# EAGLE design PISO1 (EAGLE 9.6.2)
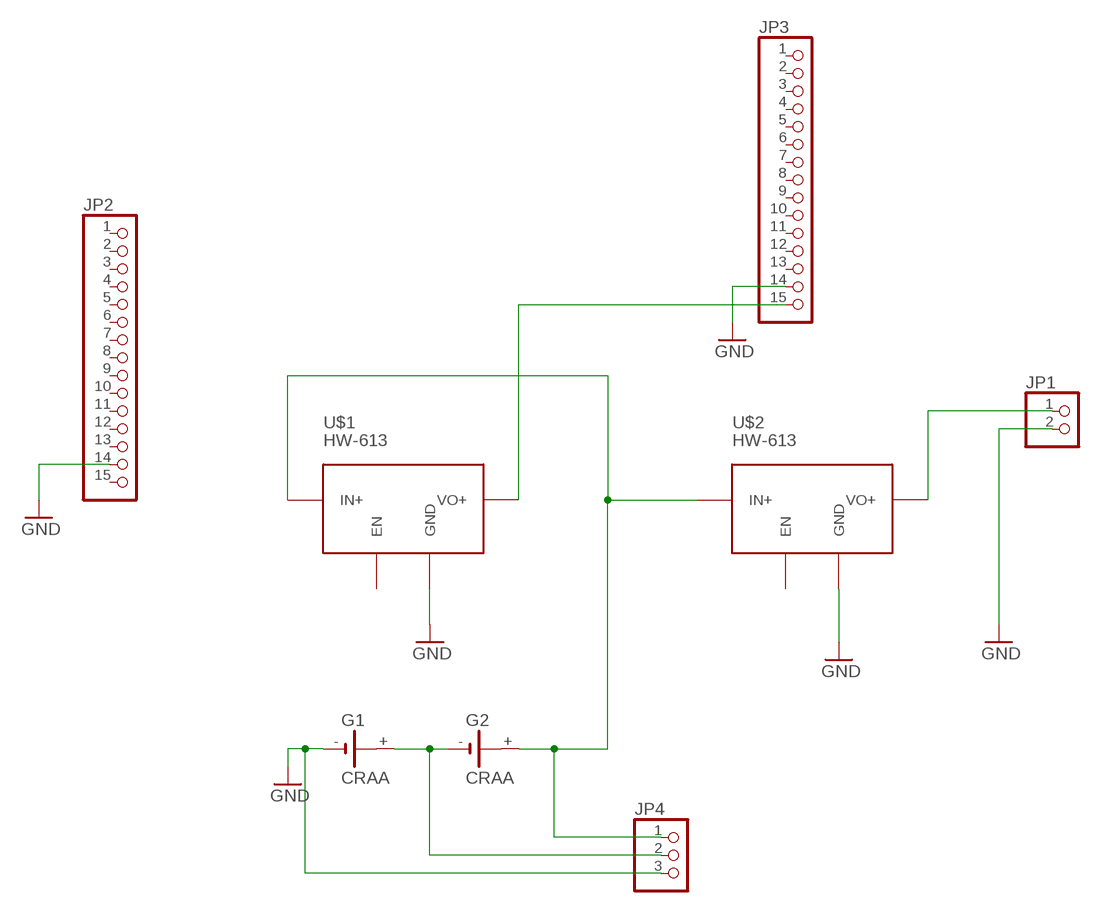
[diagram p0: schematic, sheet 1]

## Parts
G1  CRAA  [CRAA]
G2  CRAA  [CRAA]
JP1  PINHD-1X2/90  [1X02/90]
JP2  PINHD-1X15  [1X15]
JP3  PINHD-1X15  [1X15]
JP4  PINHD-1X3/90  [1X03/90]
U$1  HW-613  [HW-613]
U$2  HW-613  [HW-613]

## Nets
GND: G1.- JP1.2 JP2.14 JP3.14 JP4.3 U$1.GND U$2.GND
N$1: G1.+ G2.- JP4.2
N$4: G2.+ JP4.1 U$1.IN+ U$2.IN+
N$6: JP1.1 U$2.VO+
N$8: JP3.15 U$1.VO+
Unconnected: G1.+@1(+) G2.+@1(+) JP2.1 JP2.2 JP2.3 JP2.4 JP2.5 JP2.6 JP2.7 JP2.8 JP2.9 JP2.10 JP2.11 JP2.12 JP2.13 JP2.15 JP3.1 JP3.2 JP3.3 JP3.4 JP3.5 JP3.6 JP3.7 JP3.8 JP3.9 JP3.10 JP3.11 JP3.12 JP3.13 U$1.EN U$2.EN

## Library data of the parts
G1 G2 = battery:CRAA: LI BATTERY Varta
JP1 = pinhead:PINHD-1X2: PIN HEADER
JP2 JP3 = pinhead:PINHD-1X15: PIN HEADER
JP4 = pinhead:PINHD-1X3: PIN HEADER
U$1 U$2 = hw-613:HW-613: DC/DC Adjustable Step-Down Regulator based on MP2315 chip

## Board
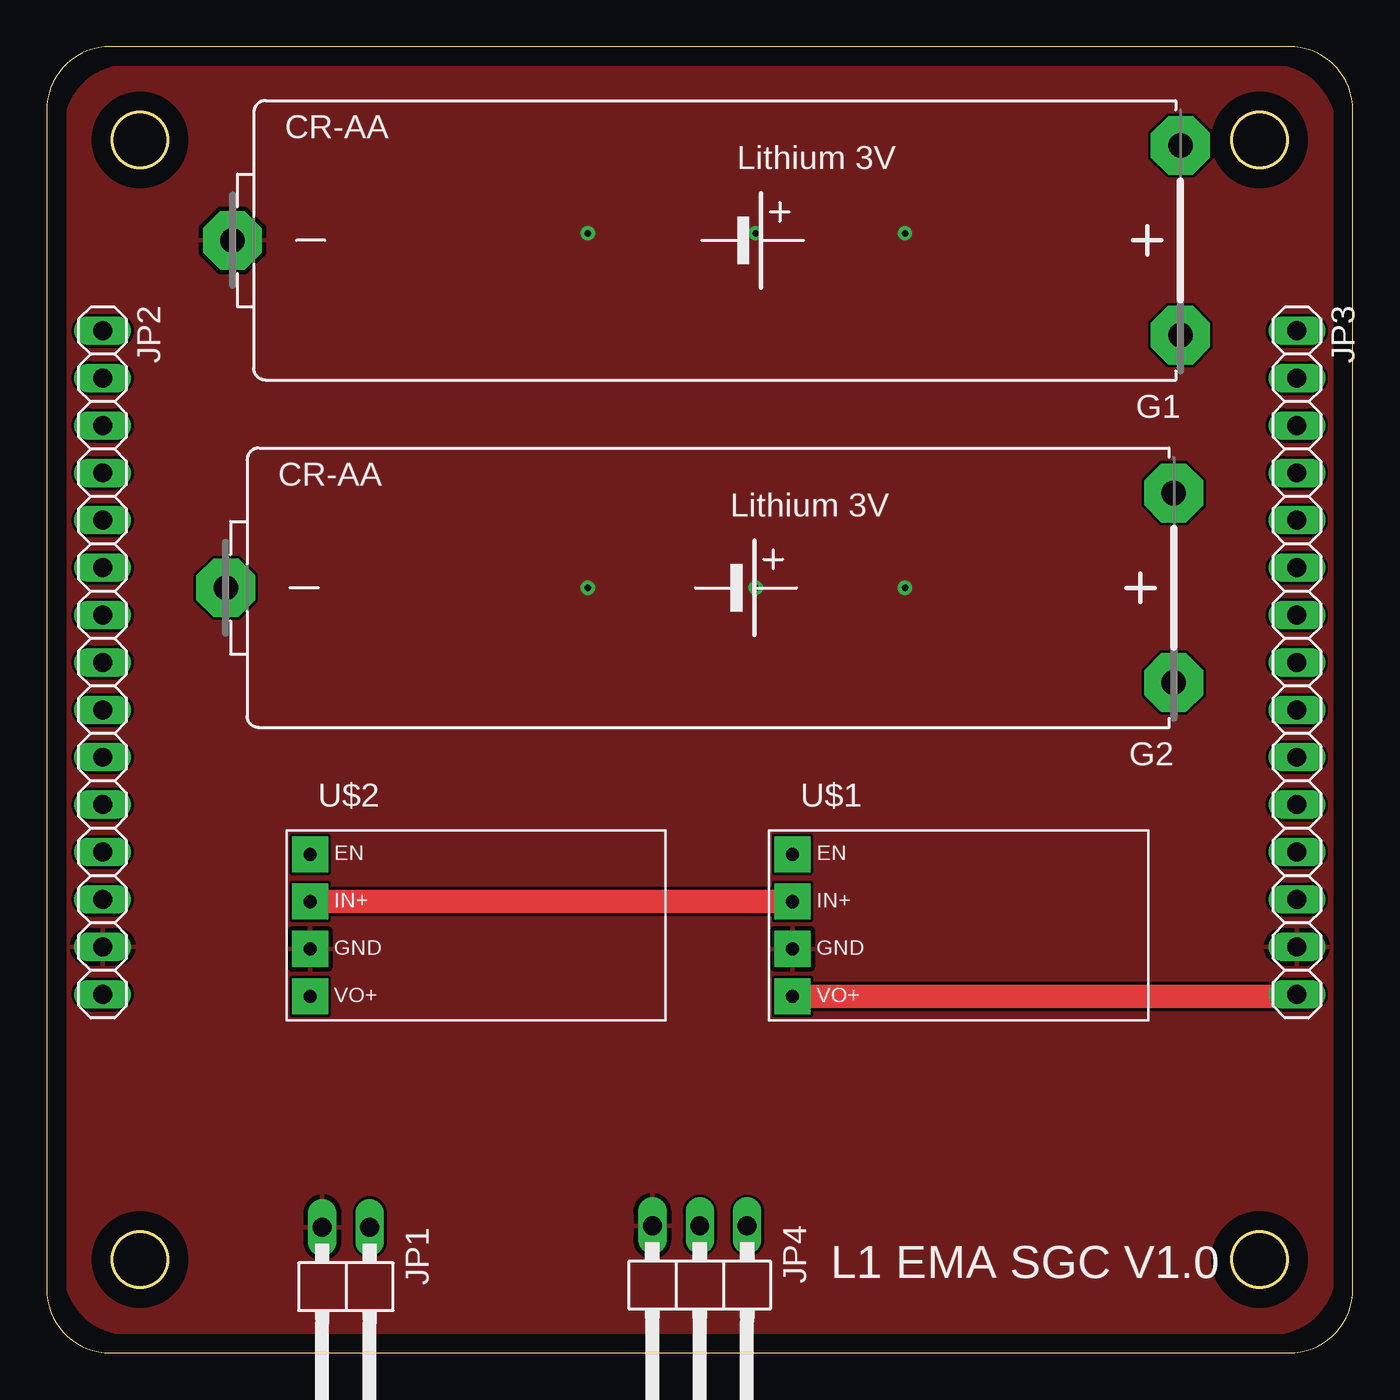
[diagram p1: board, top side]
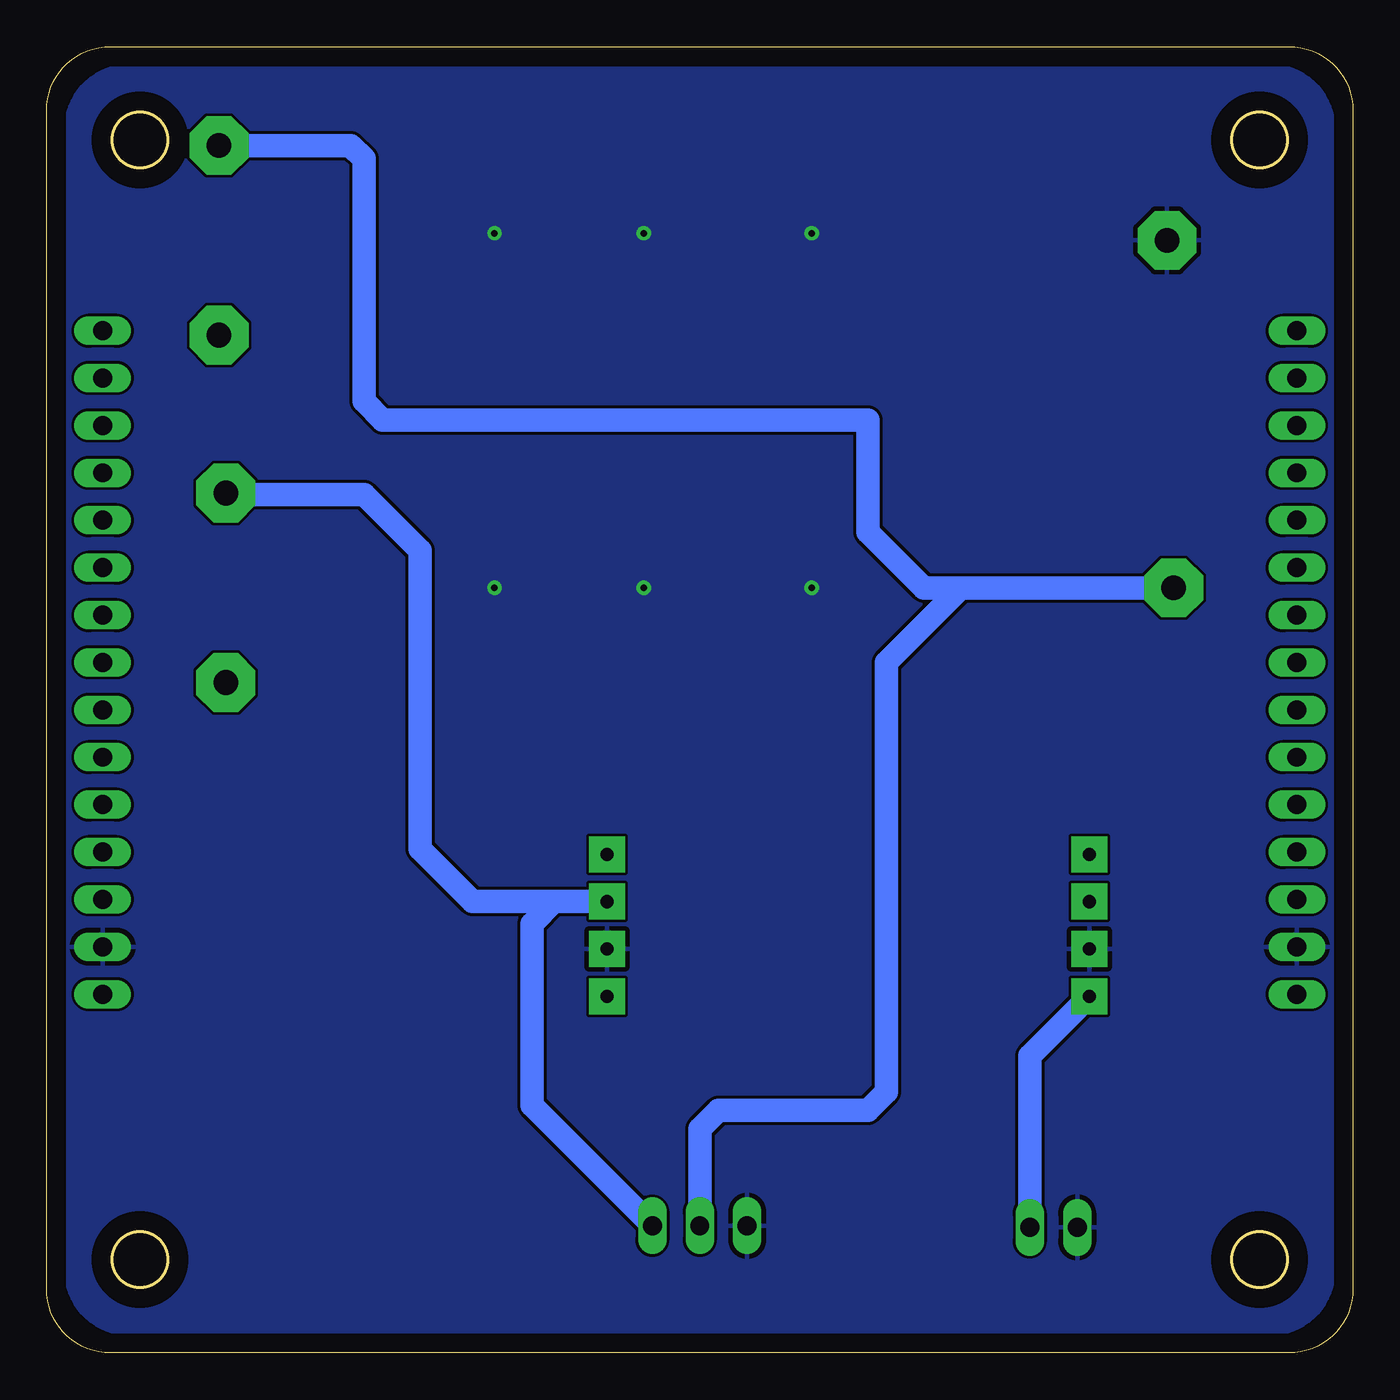
[diagram p2: board, bottom side, seen from below]

Size 70 x 70 mm. Coordinates in mm from the lower left corner, seen from the top.
Outline: 0,66.59 0,3.41 arc90 3.41,0 66.59,0 arc90 70,3.41 70,66.59 arc90 66.59,70 3.41,70 arc90 0,66.59
Outline: circle at 5,65 radius 1.5
Outline: circle at 65,65 radius 1.5
Outline: circle at 5,5 radius 1.5
Outline: circle at 65,5 radius 1.5
Copper layers (1*16): Top 0.035mm / dielectric 1.5mm / Bottom 0.035mm
Design rules "default": minimum track width 6mil, minimum drill 0.35mm, track to track 6mil, track to pad 6mil, pad to pad 6mil, via to via 6mil, smd to smd 6mil, copper to edge 40mil, drill to drill 6mil, minimum pad ring 10mil, minimum via ring 8mil, stop-mask expansion 4mil, vias tented up to drill 0mil, thermal gap 10mil

### Footprints (pad centres in the part's own frame; a part is rotated, then mirrored left to right if it is on the bottom)
CRAA = drill 1.321 pad 3.15 octagon: + -25.4,-5.08; +@1 -25.4,5.08; - 25.4,0
1X02/90 = drill 1.016 long: 1 -1.27,-3.81; 2 1.27,-3.81
1X15 = drill 1.016 long: 1 -17.78,0; 2 -15.24,0; 3 -12.7,0; 4 -10.16,0; 5 -7.62,0; 6 -5.08,0; 7 -2.54,0; 8 0,0; 9 2.54,0; 10 5.08,0; 11 7.62,0; 12 10.16,0; 13 12.7,0; 14 15.24,0; 15 17.78,0
1X03/90 = drill 1.016 long: 1 -2.54,-3.81; 2 0,-3.81; 3 2.54,-3.81
HW-613 = drill 0.7 pad 1.93 square: EN 1.27,8.89; GND 1.27,3.81; IN+ 1.27,6.35; VO+ 1.27,1.27

### Placement (x,y rotation side)
G1  35.36,59.62 180 top
G2  35,41 180 top
JP1  16.04,2.91 180 top
JP2  3,37 270 top
JP3  67,37 270 top
JP4  35,3 180 top
U$1  38.71,17.83 0 top
U$2  12.85,17.83 0 top

### Tracks (layer width: path | path; a pad name or v marks a point on that pad's centre or on a via)
GND  (via drill 0.35)
  other vias: 29,60 38,60 46,60 29,41 38,41 46,41
  pour Top: 65.59,1 4.41,1 arc-90 1,4.41 1,65.59 arc-90 4.41,69 65.59,69 arc-90 69,65.59 69,4.41 arc-90
  pour Bottom: 69,65.59 69,4.41 arc-90 65.59,1 4.41,1 arc-90 1,4.41 1,65.59 arc-90 4.41,69 65.59,69 arc-90
N$1
  Bottom 1.27: G2.- 19,41 21,41 | JP4.2 35,12 34,13 26,13 25,14 25,37 21,41 | G1.+ 53.7,64.7 53,64 53,51 52,50 26,50 26,44 23,41 21,41
N$4
  Top 1.27: U$1.IN+ U$2.IN+
  Bottom 1.27: JP4.1 44,13.27 44,23 42.82,24.18 | 42.82,24.18 42,24.18 U$1.IN+ | G2.+ 60.32,46 53,46 50,43 50,27 47.18,24.18 42.82,24.18
N$6
  Bottom 1.27: U$2.VO+ 17.31,15.91 JP1.1
N$8
  Top 1.27: U$1.VO+ 66.88,19.1 JP3.15

### Text on the board
tNames: L1 EMA SGC V1.0